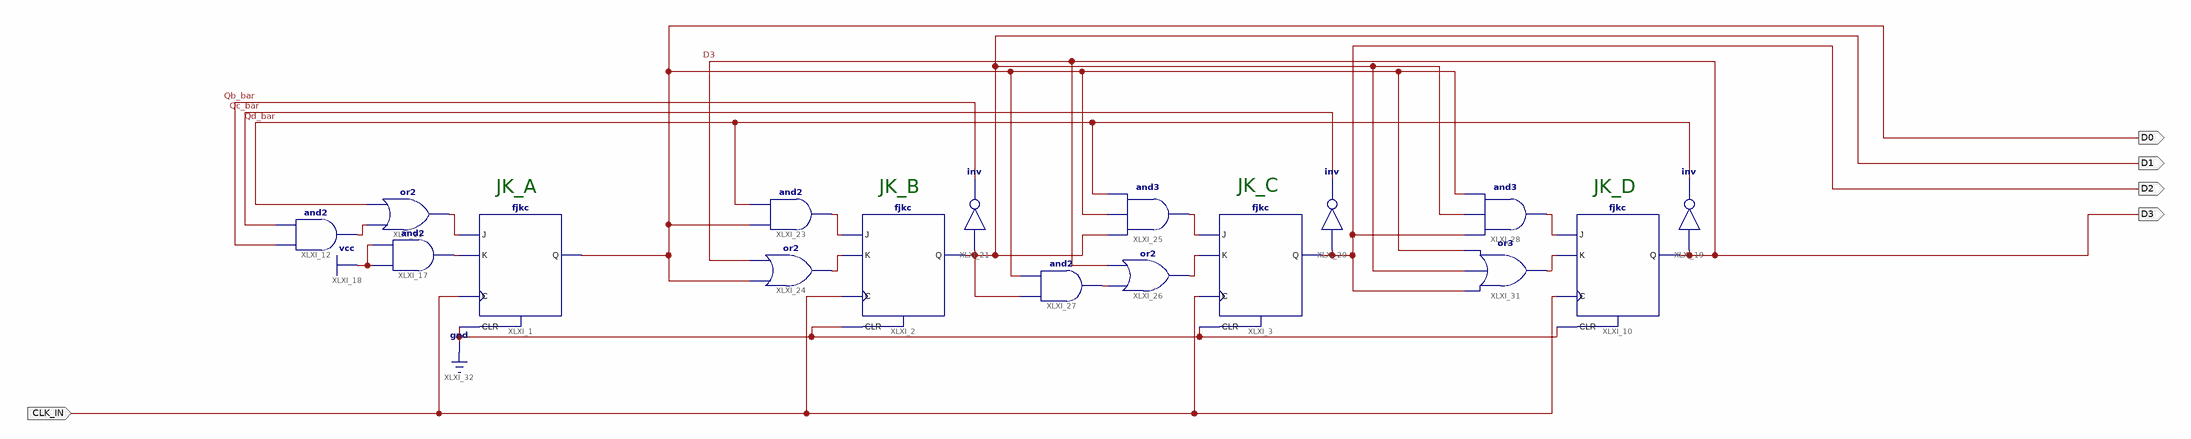
[diagram p0: schematic sheet 1]
// Xilinx ISE schematic Counter0to9.sch (spartan6) as structural Verilog: 17 symbols, 5 ports
module Counter0to9 (
  input  CLK_IN,
  output D0,
  output D1,
  output D2,
  output D3
);

  wire Qb_bar, Qc_bar, Qd_bar, XLXN_14, XLXN_15, XLXN_16, XLXN_26, XLXN_28, XLXN_30, XLXN_34, XLXN_35,
       XLXN_39, XLXN_44;

  fjkc XLXI_1 (.C(CLK_IN), .CLR(1'b0), .J(XLXN_14), .K(XLXN_16), .Q(D0));
  fjkc XLXI_2 (.C(CLK_IN), .CLR(1'b0), .J(XLXN_26), .K(XLXN_28), .Q(D1));
  fjkc XLXI_3 (.C(CLK_IN), .CLR(1'b0), .J(XLXN_30), .K(XLXN_34), .Q(D2));
  fjkc XLXI_10 (.C(CLK_IN), .CLR(1'b0), .J(XLXN_39), .K(XLXN_44), .Q(D3));
  and XLXI_12 (XLXN_15, Qb_bar, Qc_bar);
  or XLXI_11 (XLXN_14, XLXN_15, Qd_bar);
  and XLXI_17 (XLXN_16, 1'b1, 1'b1);
  not XLXI_19 (Qd_bar, D3);
  not XLXI_20 (Qc_bar, D2);
  not XLXI_21 (Qb_bar, D1);
  and XLXI_23 (XLXN_26, D0, Qd_bar);
  or XLXI_24 (XLXN_28, D0, D3);
  and XLXI_25 (XLXN_30, D1, D0, Qd_bar);
  or XLXI_26 (XLXN_34, XLXN_35, D3);
  and XLXI_27 (XLXN_35, D1, D0);
  and XLXI_28 (XLXN_39, D2, D1, D0);
  or XLXI_31 (XLXN_44, D2, D1, D0);

  // Notes on the sheet:
  //   JK_C
  //   JK_A
  //   JK_B
  //   JK_D
endmodule
